# Altium project STM32F401RCT6最小系统板.PrjPcb
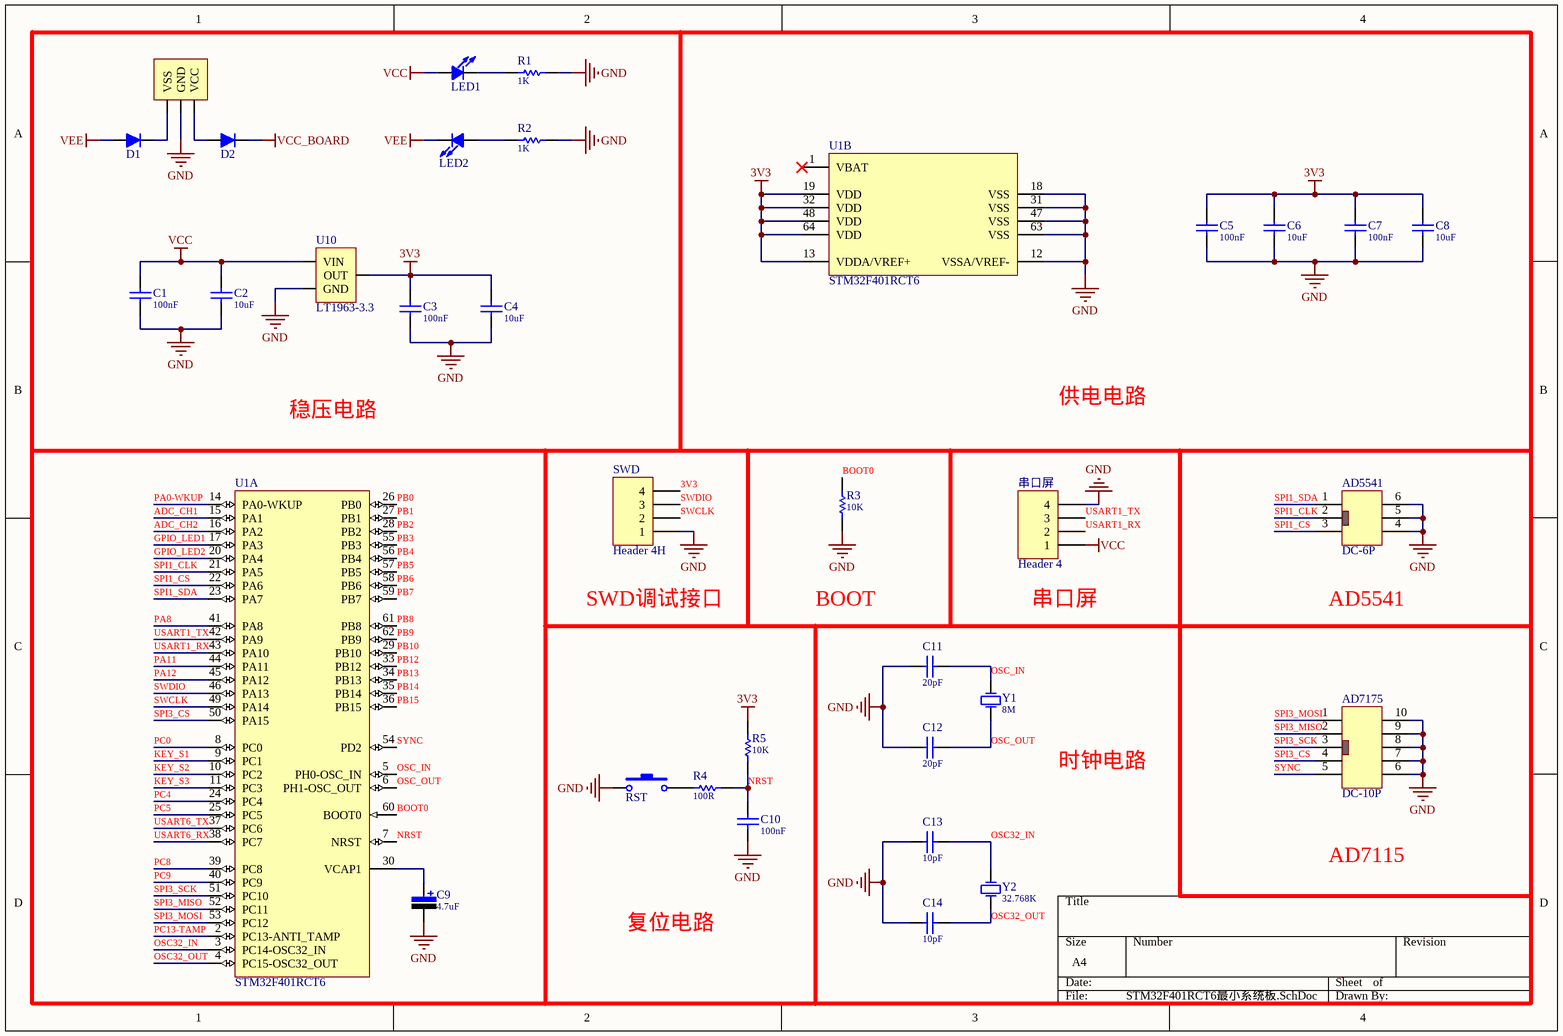
[diagram p0: STM32F401RCT6最小系统板.SchDoc]
5 sheets, 73 parts. Net scope: global (net labels, ports and power ports of the same name join across sheets).
Board file: STM32F401RCT6最小系统板.PcbDoc
Sheets:
  STM32F401RCT6最小系统板.SchDoc
  Analog.SchDoc
  Keys.SchDoc
  USB-TTL.SchDoc
  IO.SchDoc

## Sheet STM32F401RCT6最小系统板.SchDoc
size A4

### Parts
AD5541  DC-6P  [DC-6P]
AD7175  DC-10P  [DC-10P]
C1  value 100nF  [C0603-L]  (hidden comment: Cap-S)
C2  value 10uF  [C0603-L]  (hidden comment: Cap-S)
C3  value 100nF  [C0603-L]  (hidden comment: Cap-S)
C4  value 10uF  [C0603-L]  (hidden comment: Cap-S)
C5  value 100nF  [C0603-L]  (hidden comment: Cap-S)
C6  value 10uF  [C0603-L]  (hidden comment: Cap-S)
C7  value 100nF  [C0603-L]  (hidden comment: Cap-S)
C8  value 10uF  [C0603-L]  (hidden comment: Cap-S)
C9  value 4.7uF  [C-RB-SD4]  (hidden comment: C)
C10  value 100nF  [C0603-L]  (hidden comment: Cap-S)
C11  value 20pF  [C0603-L]  (hidden comment: Cap-S)
C12  value 20pF  [C0603-L]  (hidden comment: Cap-S)
C13  value 10pF  [C0603-L]  (hidden comment: Cap-S)
C14  value 10pF  [C0603-L]  (hidden comment: Cap-S)
D1  D  [D-SMA]  (value not drawn)
D2  D  [D-SMA]  (value not drawn)
J1  Power-3P  [SIPA03]  (value not drawn)
LED1  LED  [Led-0805_L]  (value not drawn)
LED2  LED  [Led-0805_L]  (value not drawn)
R1  value 1K  [R0603-L]  (hidden comment: R)
R2  value 1K  [R0603-L]  (hidden comment: R)
R3  value 10K  [R0603-L]  (hidden comment: R)
R4  value 100R  [R0603-L]  (hidden comment: R)
R5  value 10K  [R0603-L]  (hidden comment: R)
RST  SW-PB2  [SW-PB2-SMD]  (value not drawn)
SWD  Header 4H  [HDR1X4H]
U1  STM32F401RCT6  [STM-LQFP64_N]  (parts A,B of 2)
U10  LT1963-3.3  [SOT-223]
Y1  value 8M  [XTAL-PB2-DIP]  (hidden comment: XTAL)
Y2  value 32.768K  [XTAL-32768]  (hidden comment: XTAL)
串口屏  Header 4  [XH2.54-WI-4P]

### Nets
3V3: C3.2 C4.2 C5.2 C6.2 C7.2 C8.2 R5.2 SWD.4 U1.13(VDDA/VREF+) U1.19(VDD) U1.32(VDD) U1.48(VDD) U1.64(VDD) U10.2(OUT)
GND: AD5541.4 AD5541.5 AD5541.6 AD7175.6 AD7175.7 AD7175.8 AD7175.9 AD7175.10 C1.1 C2.1 C3.1 C4.1 C5.1 C6.1 C7.1 C8.1 C9.2 C10.1 C11.1 C12.1 C13.1 C14.1 J1.2(GND) R1.2 R2.2 R3.1 RST.1 SWD.1 U1.12(VSSA/VREF-) U1.18(VSS) U1.31(VSS) U1.47(VSS) U1.63(VSS) U10.1(GND) 串口屏.4
VCC: C1.2 C2.2 LED1.1 U10.3(VIN) 串口屏.1
VCC_BOARD: D2.2
VEE: D1.1 LED2.2
ADC_CH1: U1.15(PA1)
ADC_CH2: U1.16(PA2)
BOOT0: R3.2 U1.60(BOOT0)
GPIO_LED1: U1.17(PA3)
GPIO_LED2: U1.20(PA4)
KEY_S1: U1.9(PC1)
KEY_S2: U1.10(PC2)
KEY_S3: U1.11(PC3)
NRST: C10.2 R4.2 R5.1 U1.7(NRST)
OSC32_IN: C13.2 U1.3(PC14-OSC32_IN) Y2.2(OSC2)
OSC32_OUT: C14.2 U1.4(PC15-OSC32_OUT) Y2.1(OSC1)
OSC_IN: C11.2 U1.5(PH0-OSC_IN) Y1.2(OSC2)
OSC_OUT: C12.2 U1.6(PH1-OSC_OUT) Y1.1(OSC1)
PA0-WKUP: U1.14(PA0-WKUP)
PA8: U1.41(PA8)
PA11: U1.44(PA11)
PA12: U1.45(PA12)
PB0: U1.26(PB0)
PB1: U1.27(PB1)
PB2: U1.28(PB2)
PB3: U1.55(PB3)
PB4: U1.56(PB4)
PB5: U1.57(PB5)
PB6: U1.58(PB6)
PB7: U1.59(PB7)
PB8: U1.61(PB8)
PB9: U1.62(PB9)
PB10: U1.29(PB10)
PB12: U1.33(PB12)
PB13: U1.34(PB13)
PB14: U1.35(PB14)
PB15: U1.36(PB15)
PC0: U1.8(PC0)
PC4: U1.24(PC4)
PC5: U1.25(PC5)
PC8: U1.39(PC8)
PC9: U1.40(PC9)
PC13-TAMP: U1.2(PC13-ANTI_TAMP)
SPI1_CLK: AD5541.2 U1.21(PA5)
SPI1_CS: AD5541.3 U1.22(PA6)
SPI1_SDA: AD5541.1 U1.23(PA7)
SPI3_CS: AD7175.4 U1.50(PA15)
SPI3_MISO: AD7175.2 U1.52(PC11)
SPI3_MOSI: AD7175.1 U1.53(PC12)
SPI3_SCK: AD7175.3 U1.51(PC10)
SWCLK: SWD.2 U1.49(PA14)
SWDIO: SWD.3 U1.46(PA13)
SYNC: AD7175.5 U1.54(PD2)
USART1_RX: U1.43(PA10) 串口屏.2
USART1_TX: U1.42(PA9) 串口屏.3
USART6_RX: U1.38(PC7)
USART6_TX: U1.37(PC6)
NetC9_1: C9.1 U1.30(VCAP1)
NetD1_2: D1.2 J1.3(VSS)
NetD2_1: D2.1 J1.1(VCC)
NetLED1_2: LED1.2 R1.1
NetLED2_1: LED2.1 R2.1
NetR4_1: R4.1 RST.2

Not connected (* = marked no-connect by the designer): U1 1(VBAT)*

### Notes on the sheet
- 稳压电路
- 供电电路
- SWD调试接口
- BOOT
- (near 串口屏) 串口屏
- AD5541
- 时钟电路
- AD7115
- 复位电路

### Library data of the parts
C1-C8 C10-C14 = Cap-S: 贴片瓷片电容
C9 = Cap-Pol-ES: 极性贴片电解电容
D1 D2 = Diode: 二极管
J1 = Power-3P: 供电端子
LED1 LED2 = LED: 发光二极管
R1-R5 = Res: 贴片电阻
RST = SW-PB2: 贴片式2脚微动开关
SWD = Header 4H: Header, 4-Pin, Right Angle; LatestRevisionDate: 17-Jul-2002; LatestRevisionNote: Re-released for DXP Platform.; Publisher: Altium Limited
U1 = STM32F401RCT6: ARM Cortex-M4 32-bit MCU+FPU, 105 DMIPS, 256 kB Flash, 64 kB Internal RAM, 48 I/Os, 64-pin LQFP, -40 to 85 degC, Tray; Manufacturer: STMicroelectronics; FLASH Size (Prog) (kB): 256; I/Os (High Current): 48; Internal RAM Size (kB): 64; Operating Frequency(F) (Processor speed) (MHz): 84; Supply Voltage(Vcc) max (V): 3.6; Supply Voltage(Vcc) min (V): 1.8; DatasheetVersion: Rev. 1; PackageVersion: Rev. 4, 06/2013; PackageReference: LQFP64; PackageDescription: 64-Pin Low Profile Quad Flat Package, 10 x 10 mm Body, 0.5 mm Pitch; Supplier 1: Digi-Key; Supplier Part Number 1: 497-14047-ND; Supplier 2: Newark; Supplier Part Number 2: 19X6221; Supplier 3: Mouser; Supplier Part Number 3: 511-STM32F401RCT6; Core: ARM Cortex-M4; Packing: Tray; Mounting Technology: Surface Mount; PartNumber: STM32F401RCT6; ComponentLink1Description: Manufacturer URL; ComponentLink1URL: http://www.st.com/web/en/home.html; ComponentLink2Description: Datasheet; ComponentLink2URL: http://www.st.com/st-web-ui/static/active/en/resource/technical/document/data_brief/DM00071938.pdf; ComponentLink3Description: Package Specification; ComponentLink3URL: http://www.st.com/st-web-ui/static/active/en/resource/technical/document/datasheet/DM00037051.pdf
U10 = AMS1117
Y1 Y2 = XTAL: 晶振
串口屏 = Header 4: Header, 4-Pin; LatestRevisionDate: 17-Jul-2002; LatestRevisionNote: Re-released for DXP Platform.; Publisher: Altium Limited

## Sheet Analog.SchDoc
size A4
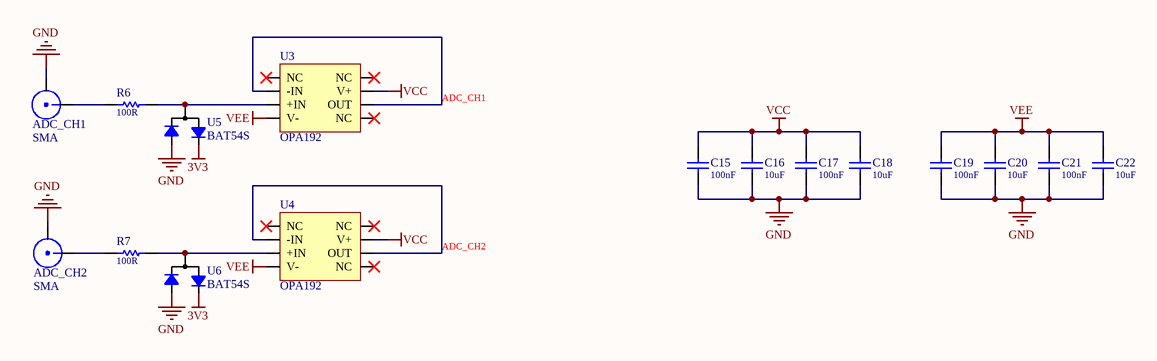
[diagram p1: Analog.SchDoc]

### Parts
ADC_CH1  SMA  [SMA1]
ADC_CH2  SMA  [SMA1]
C15  value 100nF  [C0603-L]  (hidden comment: Cap-S)
C16  value 10uF  [C0603-L]  (hidden comment: Cap-S)
C17  value 100nF  [C0603-L]  (hidden comment: Cap-S)
C18  value 10uF  [C0603-L]  (hidden comment: Cap-S)
C19  value 100nF  [C0603-L]  (hidden comment: Cap-S)
C20  value 10uF  [C0603-L]  (hidden comment: Cap-S)
C21  value 100nF  [C0603-L]  (hidden comment: Cap-S)
C22  value 10uF  [C0603-L]  (hidden comment: Cap-S)
R6  value 100R  [R0603-L]  (hidden comment: R)
R7  value 100R  [R0603-L]  (hidden comment: R)
U3  OPA192  [SOIC127P600X175-8N]
U4  OPA192  [SOIC127P600X175-8N]
U5  BAT54S  [SOT-23-3]
U6  BAT54S  [SOT-23-3]

### Nets
3V3: U5.3 U6.3
GND: ADC_CH1.2 ADC_CH2.2 C15.1 C16.1 C17.1 C18.1 C19.1 C20.1 C21.1 C22.1 U5.1 U6.1
VCC: C15.2 C16.2 C17.2 C18.2 U3.7(V+) U4.7(V+)
VEE: C19.2 C20.2 C21.2 C22.2 U3.4(V-) U4.4(V-)
ADC_CH1: U3.2(-IN) U3.6(OUT)
ADC_CH2: U4.2(-IN) U4.6(OUT)
NetADC_CH1_1: ADC_CH1.1 R6.1
NetADC_CH2_1: ADC_CH2.1 R7.1
NetR6_2: R6.2 U3.3(+IN) U5.2
NetR7_2: R7.2 U4.3(+IN) U6.2

Not connected (* = marked no-connect by the designer): U3 1(NC)* 5(NC)* 8(NC)*; U4 1(NC)* 5(NC)* 8(NC)*

### Library data of the parts
C15-C22 = Cap-S: 贴片瓷片电容
R6 R7 = Res: 贴片电阻

## Sheet Keys.SchDoc
size A4
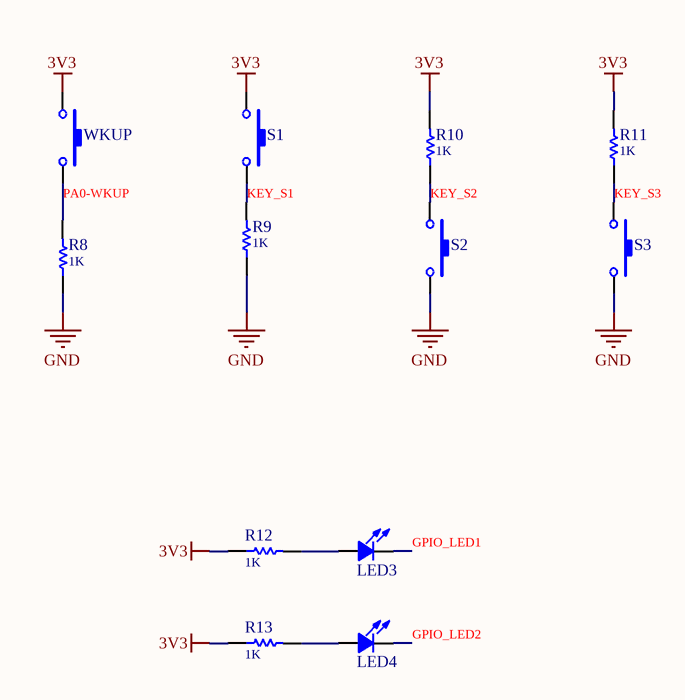
[diagram p2: Keys.SchDoc]

### Parts
LED3  LED  [Led-0805_L]  (value not drawn)
LED4  LED  [Led-0805_L]  (value not drawn)
R8  value 1K  [R0603-L]  (hidden comment: R)
R9  value 1K  [R0603-L]  (hidden comment: R)
R10  value 1K  [R0603-L]  (hidden comment: R)
R11  value 1K  [R0603-L]  (hidden comment: R)
R12  value 1K  [R0603-L]  (hidden comment: R)
R13  value 1K  [R0603-L]  (hidden comment: R)
S1  SW-PB2  [SW-PB2-SMD]  (value not drawn)
S2  SW-PB2  [SW-PB2-SMD]  (value not drawn)
S3  SW-PB2  [SW-PB2-SMD]  (value not drawn)
WKUP  SW-PB2  [SW-PB2-SMD]  (value not drawn)

### Nets
3V3: R10.2 R11.2 R12.1 R13.1 S1.1 WKUP.1
GND: R8.1 R9.1 S2.2 S3.2
GPIO_LED1: LED3.2
GPIO_LED2: LED4.2
KEY_S1: R9.2 S1.2
KEY_S2: R10.1 S2.1
KEY_S3: R11.1 S3.1
PA0-WKUP: R8.2 WKUP.2
NetLED3_1: LED3.1 R12.2
NetLED4_1: LED4.1 R13.2

### Library data of the parts
LED3 LED4 = LED: 发光二极管
R8-R13 = Res: 贴片电阻
S1-S3 WKUP = SW-PB2: 贴片式2脚微动开关

## Sheet USB-TTL.SchDoc
size A4
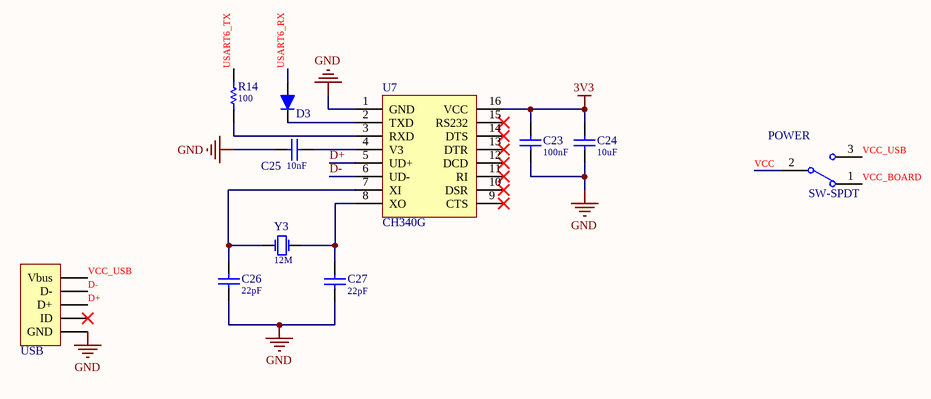
[diagram p3: USB-TTL.SchDoc]

### Parts
C23  value 100nF  [C0603-L]  (hidden comment: Cap-S)
C24  value 10uF  [C0603-L]  (hidden comment: Cap-S)
C25  value 10nF  [C0603-L]  (hidden comment: Cap-S)
C26  value 22pF  [C0603-L]  (hidden comment: Cap-S)
C27  value 22pF  [C0603-L]  (hidden comment: Cap-S)
D3  D  [D-SMA]  (value not drawn)
POWER  SW-SPDT  [SW-SPDT]
R14  value 100  [R0603-L]  (hidden comment: R)
U7  CH340G  [SOP-16]
USB  USB_Mini/Micro  [USB_Micro]  (value not drawn)
Y3  value 12M  [XTAL-PB2-DIP]  (hidden comment: XTAL)

### Nets
3V3: C23.2 C24.2 U7.16(VCC)
GND: C23.1 C24.1 C25.1 C26.1 C27.1 U7.1(GND) USB.5(GND)
VCC: POWER.2
VCC_BOARD: POWER.1
D+: U7.5(UD+) USB.3(D+)
D-: U7.6(UD-) USB.2(D-)
USART6_RX: D3.1
USART6_TX: R14.2
VCC_USB: POWER.3 USB.1(Vbus)
NetC25_2: C25.2 U7.4(V3)
NetC26_2: C26.2 U7.7(XI) Y3.1(OSC1)
NetC27_2: C27.2 U7.8(XO) Y3.2(OSC2)
NetD3_2: D3.2 U7.2(TXD)
NetR14_1: R14.1 U7.3(RXD)

Not connected (* = marked no-connect by the designer): U7 9(CTS)* 10(DSR)* 11(RI)* 12(DCD)* 13(DTR)* 14(DTS)* 15(RS232)*; USB 4(ID)*

### Library data of the parts
C23-C27 = Cap-S: 贴片瓷片电容
D3 = Diode: 二极管
POWER = SW-SPDT: SPDT Subminiature Toggle Switch, Right Angle Mounting, Vertical Actuation; ComponentLink1Description: Manufacturer Link; ComponentLink1URL: http://www.apem.com
R14 = Res: 贴片电阻
U7 = CH340G: SOP16
USB = USB: Mini/Micro USB母口
Y3 = XTAL: 晶振

## Sheet IO.SchDoc
size A4
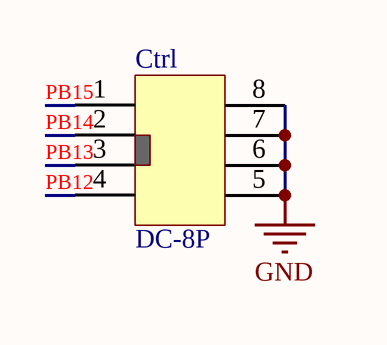
[diagram p4: IO.SchDoc]

### Parts
Ctrl  DC-8P  [DC-8P]

### Nets
GND: Ctrl.5 Ctrl.6 Ctrl.7 Ctrl.8
PB12: Ctrl.4
PB13: Ctrl.3
PB14: Ctrl.2
PB15: Ctrl.1

## Nets that join several sheets
3V3: STM32F401RCT6最小系统板 (14 pins), Analog (U5.3 U6.3), Keys (6 pins), USB-TTL (C23.2 C24.2 U7.16)
GND: STM32F401RCT6最小系统板 (35 pins), Analog (12 pins), Keys (R8.1 R9.1 S2.2 S3.2), USB-TTL (7 pins), IO (Ctrl.5 Ctrl.6 Ctrl.7 Ctrl.8)
VCC: STM32F401RCT6最小系统板 (5 pins), Analog (6 pins), USB-TTL (POWER.2)
VCC_BOARD: STM32F401RCT6最小系统板 (D2.2), USB-TTL (POWER.1)
VEE: STM32F401RCT6最小系统板 (D1.1 LED2.2), Analog (6 pins)
ADC_CH1: STM32F401RCT6最小系统板 (U1.15), Analog (U3.2 U3.6)
ADC_CH2: STM32F401RCT6最小系统板 (U1.16), Analog (U4.2 U4.6)
GPIO_LED1: STM32F401RCT6最小系统板 (U1.17), Keys (LED3.2)
GPIO_LED2: STM32F401RCT6最小系统板 (U1.20), Keys (LED4.2)
KEY_S1: STM32F401RCT6最小系统板 (U1.9), Keys (R9.2 S1.2)
KEY_S2: STM32F401RCT6最小系统板 (U1.10), Keys (R10.1 S2.1)
KEY_S3: STM32F401RCT6最小系统板 (U1.11), Keys (R11.1 S3.1)
PA0-WKUP: STM32F401RCT6最小系统板 (U1.14), Keys (R8.2 WKUP.2)
PB12: STM32F401RCT6最小系统板 (U1.33), IO (Ctrl.4)
PB13: STM32F401RCT6最小系统板 (U1.34), IO (Ctrl.3)
PB14: STM32F401RCT6最小系统板 (U1.35), IO (Ctrl.2)
PB15: STM32F401RCT6最小系统板 (U1.36), IO (Ctrl.1)
USART6_RX: STM32F401RCT6最小系统板 (U1.38), USB-TTL (D3.1)
USART6_TX: STM32F401RCT6最小系统板 (U1.37), USB-TTL (R14.2)